# EAGLE schematic Power Supply Board (EAGLE 9.6.2)
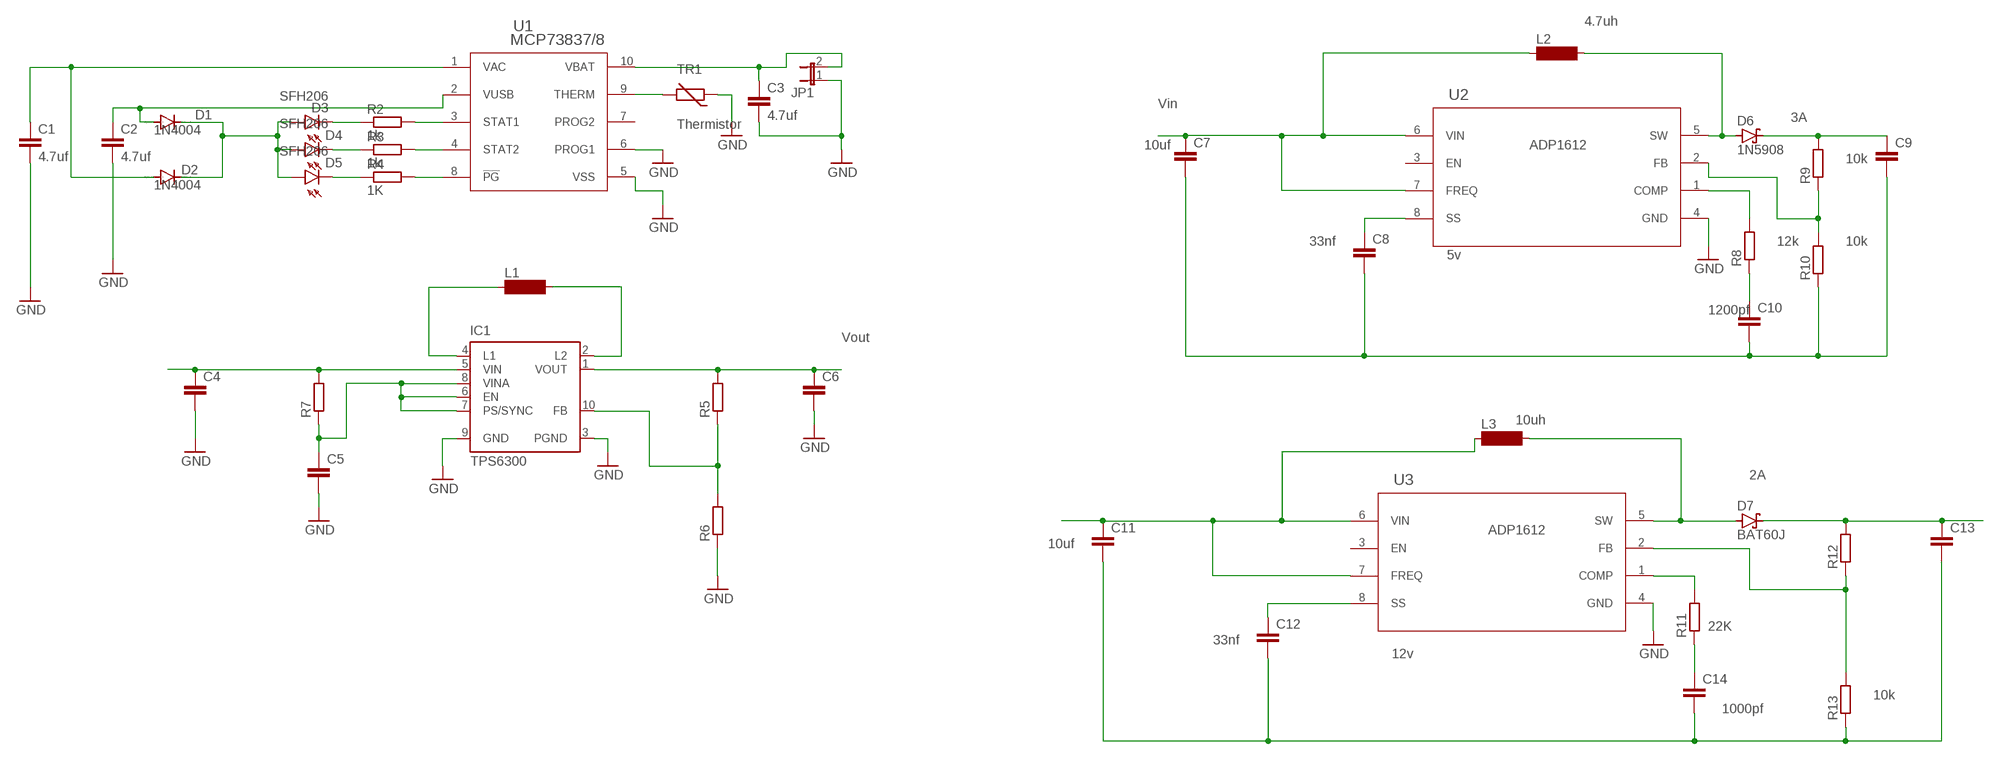
[diagram p0: schematic, sheet 1]

## Parts
C1  4.7uf  C2,5-3  [C2.5-3]
C2  4.7uf  C2,5-3  [C2.5-3]
C3  4.7uf  C2,5-3  [C2.5-3]
C4  C2,5-3  [C2.5-3]
C5  C2,5-3  [C2.5-3]
C6  C2,5-3  [C2.5-3]
C7  C2.5/2  [C2.5-2]
C8  C2.5/2  [C2.5-2]
C9  C2.5/2  [C2.5-2]
C10  C2.5/2  [C2.5-2]
C11  C2.5/2  [C2.5-2]
C12  C2.5/2  [C2.5-2]
C13  C2.5/2  [C2.5-2]
C14  C2.5/2  [C2.5-2]
D1  1N4004  [DO41-10]
D2  1N4004  [DO41-10]
D3  SFH206  [SFH206]
D4  SFH206  [SFH206]
D5  SFH206  [SFH206]
D6  1N5908  [C4111-15]
D7  BAT60J  [SOD323_ST]
IC1  TPS6300  [DRC-S-PVSON-N10]
JP1  JP1E  [JP1]
L1  SM-NE29  [SM-NE29]
L2  SM-NE29  [SM-NE29]
L3  SM-NE29  [SM-NE29]
R2  1k  R-EU_0204/5  [0204/5]
R3  1k  R-EU_0204/5  [0204/5]
R4  1K  R-EU_0204/5  [0204/5]
R5  R-EU_0204/2V  [0204V]
R6  R-EU_0204/2V  [0204V]
R7  R-EU_0204/2V  [0204V]
R8  R-EU_V235/17  [V235/17]
R9  R-EU_V235/17  [V235/17]
R10  R-EU_V235/17  [V235/17]
R11  R-EU_0207/15  [0207/15]
R12  R-EU_0207/15  [0207/15]
R13  R-EU_0207/15  [0207/15]
TR1  Thermistor  THERMISTOR_R-5  [R-5]
U1  MCP73837/8  MCP73837-FCI/UN  [MSOP10_MC_MCH]
U2  ADP1612  [RM_8_ADI]
U3  ADP1612RM_8_ADI-L  [RM_8_ADI-L]

## Nets
GND: C1.2 C2.2 C3.2 C4.2 C5.2 C6.2 IC1.3(PGND) IC1.9(GND) JP1.1 R6.1 TR1.1 U1.5(VSS) U1.6(PROG1) U2.4(GND) U3.4(GND)
N$1: C3.1 JP1.2 U1.10(VBAT)
N$2: D3.K(C) R2.1
N$3: TR1.2 U1.9(THERM)
N$4: R4.2 U1.8(!PG)
N$5: R3.2 U1.4(STAT2)
N$6: R2.2 U1.3(STAT1)
N$7: D4.K(C) R3.1
N$8: D5.K(C) R4.1
N$9: C2.1 D1.A U1.2(VUSB)
N$10: C1.1 D2.A U1.1(VAC)
N$11: D1.C D2.C D3.A D4.A D5.A
N$12: C6.1 IC1.1(VOUT) R5.2
N$13: IC1.10(FB) R5.1 R6.2
N$14: C4.1 IC1.5(VIN) R7.2
N$15: C5.1 IC1.6(EN) IC1.7(PS/SYNC) IC1.8(VINA) R7.1
N$16: IC1.4(L1) L1.1
N$17: IC1.2(L2) L1.2
N$18: C7.1 L2.1 U2.6(VIN) U2.7(FREQ)
N$19: C8.1 U2.8(SS)
N$20: D6.A L2.2 U2.5(SW)
N$21: C9.1 D6.C R9.2
N$22: R8.2 U2.1(COMP)
N$23: R9.1 R10.2 U2.2(FB)
N$24: D7.A L3.2 U3.5(SW)
N$25: C10.1 R8.1
N$26: C13.1 D7.C R12.2
N$27: R11.2 U3.1(COMP)
N$28: R12.1 R13.2 U3.2(FB)
N$29: C14.1 R11.1
N$30: C7.2 C8.2 C9.2 C10.2 R10.1
N$31: C11.1 L3.1 U3.6(VIN) U3.7(FREQ)
N$33: C12.1 U3.8(SS)
N$34: C11.2 C12.2 C13.2 C14.2 R13.1
Unconnected: IC1.TH U1.7(PROG2) U2.3(EN) U3.3(EN)

## Notes on the sheet
- 4.7uh
- Vin
- 3A
- 10uf | ADP1612
- 10k
- 33nf | 12k | 10k
- 5v
- 1200pf
- Vout
- 10uh
- 2A
- ADP1612
- 10uf
- 22K
- 33nf
- 12v
- 10k
- 1000pf

## Library data of the parts
C1-C14 = capacitor-wima:C: CAPACITOR naming: grid - package width
D1 D2 = diode:1N4004: DIODE general purpose rectifier, 1 A
D3-D5 = opto-trans-siemens:SFH206: PHOTO DIODE; MPN: SFH206K; OC_FARNELL: 1212741; OC_NEWARK: 01M8807
D6 = diode:1N5908: DIODE schottky
D7 = diode:BAT60J: Schottky barrier diode Source: www.st.com, BAT60J.pdf
IC1 = texas:TPS6300*: HIGH EFFICIENT SINGLE INDUCTOR BUCK-BOOST CONVERTER WITH 1.8-A SWITCHES Source: http://focus.ti.com/lit/ds/symlink/tps63001.pdf; MPN: TPS63000DRCTG4; OC_FARNELL: 1511852; OC_NEWARK: 59M7217
JP1 = jumper:JP1E: JUMPER
L1-L3 = inductor-neosid:SM-NE29: INDUCTOR SMD chip inductor; OC_FARNELL: unknown; OC_NEWARK: unknown
R2-R13 = rcl:R-EU_: RESISTOR, European symbol; SPICEPREFIX: R
TR1 = discrete:THERMISTOR_: Thermo Resistor
U1 = ultra librarian:MCP73837-FCI/UN: MCP73837 Battery charge controller , MCP 73837 - Li-Ion/Li-Polymer Battery Charge Management Controller; BUILT_BY: EMA_UL_Team; MANUFACTURER_PART_NUMBER: MCP73837-FCI/UN; SOURCELIBRARY: Microchip_2011-05-13; VENDOR: Microchip
U2 U3 = ultra librarian:ADP1612: ADP 1612/1613 , ADP 1612, ADP1613, DC - DC step up converter; BUILT_BY: EMA_UL_Team; MANUFACTURER_PART_NUMBER: ADP1612ARMZ-R7; SOURCELIBRARY: Analog_2015-12-15; VENDOR: Analog Devices Inc